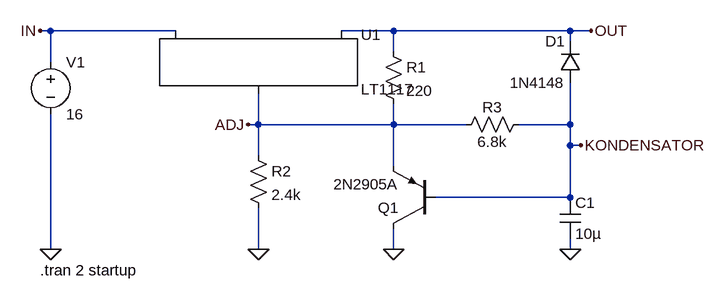
[diagram p0: schematic zad5_lista4.asc]
zad5_lista4.asc, the LTspice schematic file:
Version 4.1
SHEET 1 888 680
WIRE -128 128 -144 128
WIRE 64 128 -128 128
WIRE 400 128 320 128
WIRE 672 128 400 128
WIRE 704 128 672 128
WIRE 672 144 672 128
WIRE 400 160 400 128
WIRE -128 176 -128 128
WIRE 192 272 192 224
WIRE 192 272 176 272
WIRE 400 272 400 240
WIRE 400 272 192 272
WIRE 512 272 400 272
WIRE 672 272 672 208
WIRE 672 272 592 272
WIRE 672 304 672 272
WIRE 688 304 672 304
WIRE 192 320 192 272
WIRE 400 336 400 272
WIRE 672 384 672 304
WIRE 672 384 464 384
WIRE -128 464 -128 256
WIRE 192 464 192 400
WIRE 400 464 400 432
WIRE 672 464 672 448
FLAG -128 464 0
FLAG 192 464 0
FLAG 688 304 KONDENSATOR
FLAG 704 128 OUT
FLAG -144 128 IN
FLAG 176 272 ADJ
FLAG 400 464 0
FLAG 672 464 0
SYMBOL PowerProducts\\LT1117 192 128 R0
SYMATTR InstName U1
SYMBOL voltage -128 160 R0
WINDOW 123 0 0 Left 0
WINDOW 39 0 0 Left 0
SYMATTR InstName V1
SYMATTR Value 16
SYMBOL res 176 304 R0
SYMATTR InstName R2
SYMATTR Value 2.4k
SYMBOL res 384 144 R0
SYMATTR InstName R1
SYMATTR Value 220
SYMBOL diode 688 208 R180
WINDOW 0 24 64 Left 2
WINDOW 3 24 0 Left 2
SYMATTR InstName D1
SYMATTR Value 1N4148
SYMBOL pnp 464 432 R180
SYMATTR InstName Q1
SYMATTR Value 2N2905A
SYMBOL cap 656 384 R0
SYMATTR InstName C1
SYMATTR Value 10µ
SYMBOL res 496 288 R270
WINDOW 0 27 56 VTop 2
WINDOW 3 5 56 VBottom 2
SYMATTR InstName R3
SYMATTR Value 6.8k
TEXT -144 496 Left 2 !.tran 2 startup

The netlist it stands for:
* zad5_lista4.asc
X§U1 ADJ OUT IN LT1117
V1 IN 0 16
R2 ADJ 0 2.4k
R1 OUT ADJ 220
D1 KONDENSATOR OUT 1N4148
Q1 0 KONDENSATOR ADJ 0 2N2905A
C1 KONDENSATOR 0 10µ
R3 ADJ KONDENSATOR 6.8k
.model D D
.lib standard.dio
.model NPN NPN
.model PNP PNP
.lib standard.bjt
.tran 2 startup
.lib LT1117.lib
.backanno
.end